# EAGLE design adapter (EAGLE 8.2.1)
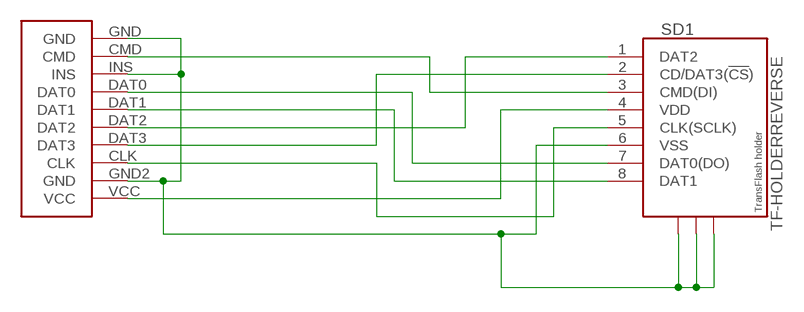
[diagram p0: schematic, sheet 1]

## Parts
SD1  TF-HOLDERREVERSE  [TF-PULL-REVERSE]
U$1  CONNECTOR  [CONNECTOR]

## Nets
CLK: SD1.5(CLK(SCLK)) U$1.CLK
CMD: SD1.3(CMD(DI)) U$1.CMD
DAT0: SD1.7(DAT0(DO)) U$1.DAT0
DAT1: SD1.8(DAT1) U$1.DAT1
DAT2: SD1.1(DAT2) U$1.DAT2
DAT3: SD1.2(CD/DAT3(!CS!)) U$1.DAT3
GND: SD1.6(VSS) SD1.S1 SD1.S2 SD1.S3 U$1.GND U$1.GND2(GND) U$1.INS
VCC: SD1.4(VDD) U$1.VCC

## Library data of the parts
SD1 = sd-mmc:TF-HOLDER: TF / Micro SD socket is PUSH-PUSH type, the card can be pushed into and auto locked and pushed out by simply press the card. Surface Mounting type.
U$1 = untitled:CONNECTOR

## Board
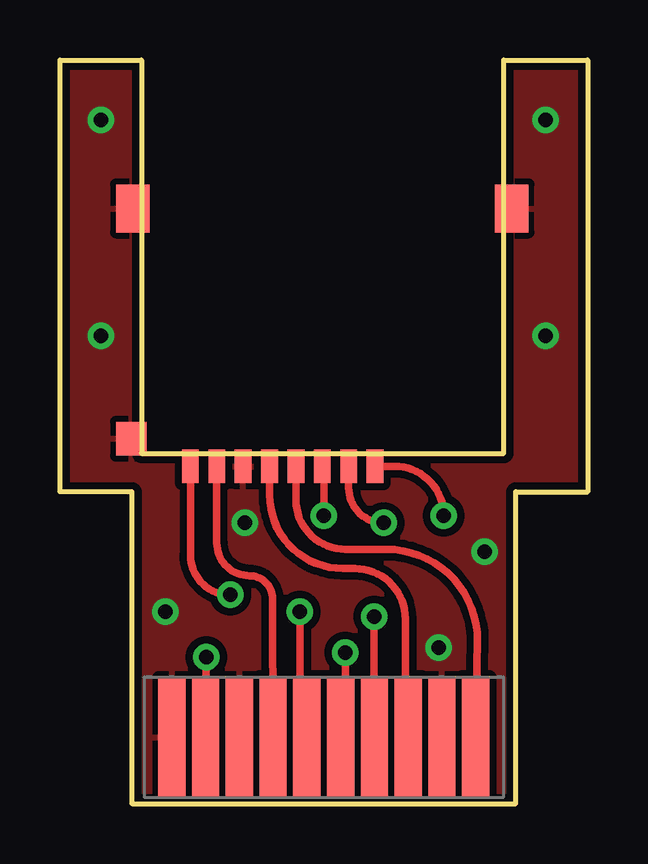
[diagram p1: board, top side]
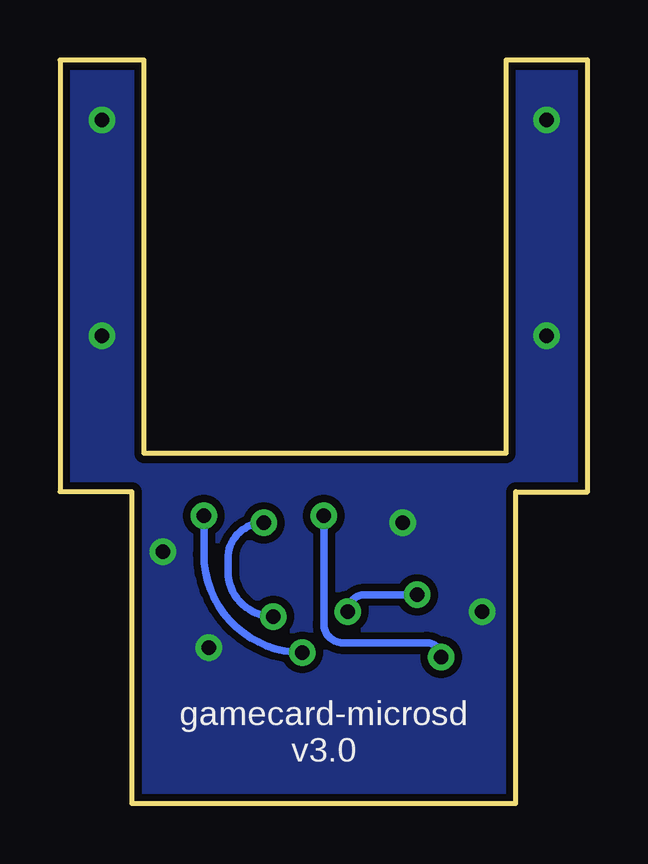
[diagram p2: board, bottom side, seen from below]

Size 22 x 31 mm. Coordinates in mm from the lower left corner, seen from the top.
Outline: 3,0 19,0 19,13 22,13 22,31 18.5,31 18.5,14.6 3.4,14.6 3.4,31 0,31 0,13 3,13 3,0
Copper layers (1*16): Top 0.035mm / dielectric 1.5mm / Bottom 0.035mm
Design rules "SparkFun": minimum track width 8mil, minimum drill 20mil, track to track 8mil, track to pad 8mil, pad to pad 8mil, via to via 8mil, smd to smd 8mil, copper to edge 10mil, drill to drill 8mil, minimum pad ring 12mil, minimum via ring 10mil, stop-mask expansion 4mil, vias tented up to drill 25mil, thermal gap 10mil

### Footprints (pad centres in the part's own frame; a part is rotated, then mirrored left to right if it is on the bottom)
TF-PULL-REVERSE = smd 0.7 x 1.4: 1 2.2,-7.9; 2 1.1,-7.9; 3 0,-7.9; 4 -1.1,-7.9; 5 -2.2,-7.9; 6 -3.3,-7.9; 7 -4.4,-7.9; 8 -5.5,-7.9 | smd 1.4 x 2: S1 7.9,2.85; S2 -7.9,2.85 | smd 1.28 x 1.4: S3 -7.96,-6.75
CONNECTOR = smd 1.137 x 5: CLK 3.518,0; CMD -4.925,0; DAT0 -2.111,0; DAT1 -0.704,0; DAT2 0.704,0; DAT3 2.111,0; GND -6.332,0; GND2 4.925,0; INS -3.518,0; VCC 6.332,0

### Placement (x,y rotation side)
SD1  10.94,21.96 0 top
U$1  11,2.77 0 top

### Tracks (layer width: path | path; a pad name or v marks a point on that pad's centre or on a via)
CLK
  Top 0.305: SD1.5 8.74,12.86 arc90 11.8,9.8 12.3,9.8 arc-90 14.4,7.7 14.4,2.89 arc90 U$1.CLK
CMD  (via drill 0.6)
  Top 0.305: 6.01,4.91 U$1.CMD arc90 6.1,2.86 v6.1,6.1 | SD1.3 arc-90 11,14 v11,12
  Bottom 0.305: v11,12 11,7.5 arc-90 10.2,6.7 6.7,6.7 arc90 v6.1,6.1
DAT0
  Top 0.305: U$1.DAT0 8.86,8.54 arc90 7.9,9.5 arc-90 6.54,10.86 SD1.7
DAT1  (via drill 0.6)
  Top 0.305: SD1.8 5.44,10.36 arc90 v7.1,8.7 | v10,8 10,3.06 arc90 U$1.DAT1
  Bottom 0.305: v7.1,8.7 9.3,8.7 arc-90 v10,8
DAT2  (via drill 0.6)
  Top 0.305: SD1.1 13.94,14.06 arc-90 v16,12 | 11.71,2.79 arc90 11.3,3.2 | 11.71,2.79 U$1.DAT2 | v11.9,6.3 11.9,2.98 arc-90 11.71,2.79
  Bottom 0.305: v16,12 16,10.4 arc-90 v11.9,6.3
DAT3  (via drill 0.6)
  Top 0.305: SD1.2 12.04,13.16 arc90 v13.5,11.7 | v13.1,7.8 13.1,2.81 arc90 U$1.DAT3
  Bottom 0.305: v13.5,11.7 arc-90 15,10.2 15,9.7 arc-90 v13.1,7.8
GND  (via drill 0.6)
  other vias: 7.7,11.7 4.4,8 17.7,10.5 15.8,6.5 1.7,28.5 20.25,28.5 1.7,19.5 20.25,19.5
  pour Top (isolate 0.305): 0,31 3.4,31 3.4,14.7 3.5,14.6 18.4,14.6 18.5,31 22,31 22,13 19,13 19,0 3,0 3,13 0,13
  pour Bottom (isolate 0.305): 0,31 3.4,31 3.4,14.7 3.5,14.6 18.4,14.6 18.4,16.1 18.5,16.2 18.5,31 22,31 22,13 19,13 19,0 3,0 3,13 0,13
VCC
  Top 0.305: SD1.4 9.84,12.66 arc90 11.9,10.6 13.6,10.6 arc-90 17.41,6.79 U$1.VCC

### Text on the board
bNames: gamecard-microsd / v3.0